# EAGLE design NV08C_GPS_shield (EAGLE 6.4)
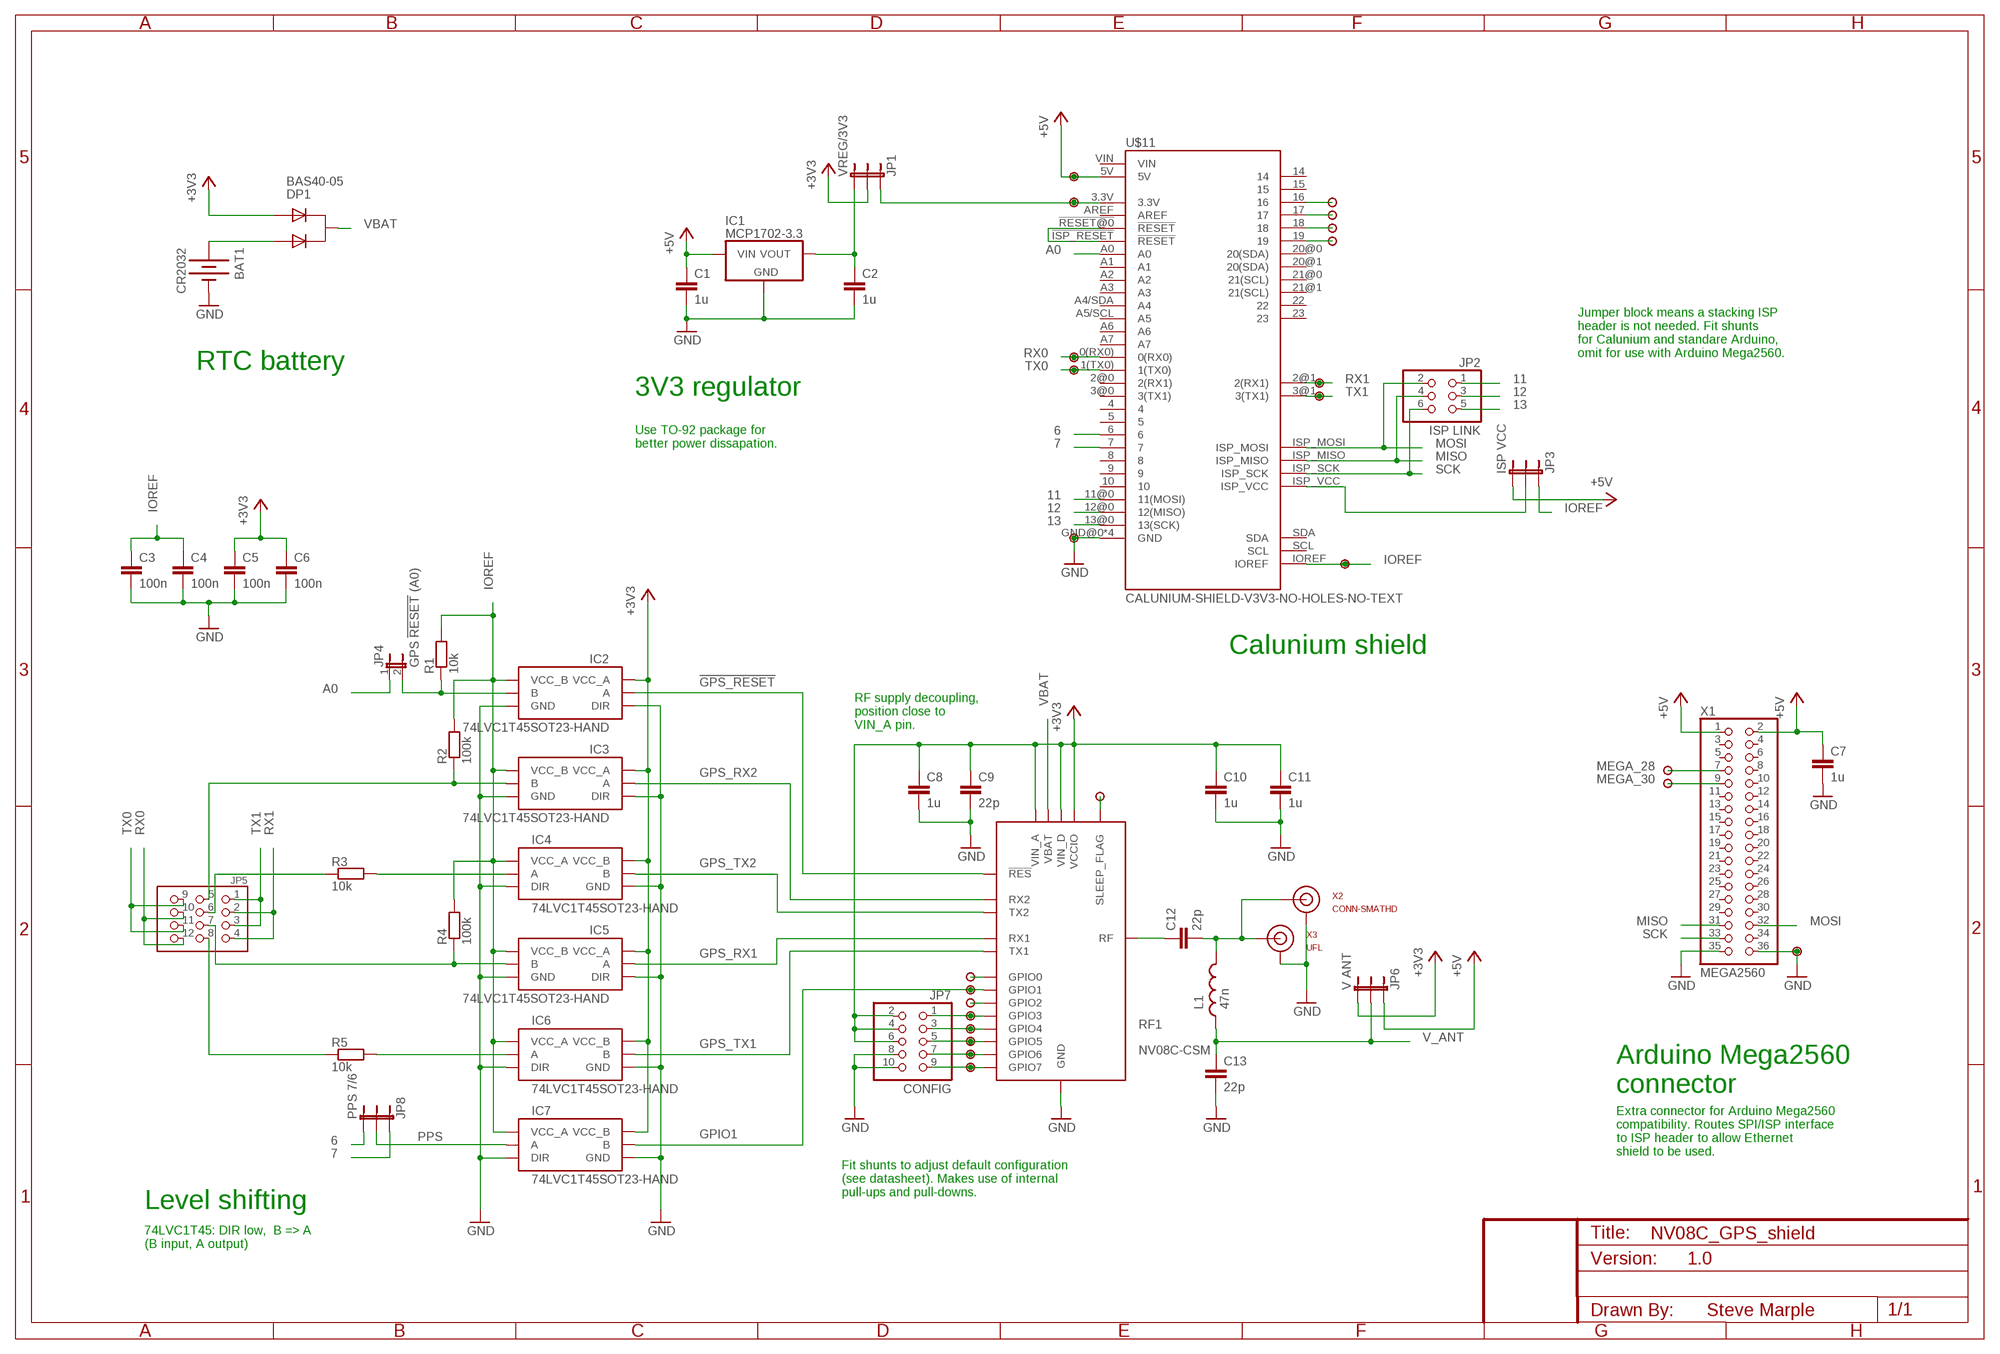
[diagram p0: schematic, sheet 1]

## Parts
BAT1  CR2032  BATTERY20PTH  [BATTCOM_20MM_PTH]
C1  1u  C-EU1206-HAND  [1206-HAND]
C2  1u  C-EU1206-HAND  [1206-HAND]
C3  100n  C-EU1206-HAND  [1206-HAND]
C4  100n  C-EU1206-HAND  [1206-HAND]
C5  100n  C-EU1206-HAND  [1206-HAND]
C6  100n  C-EU1206-HAND  [1206-HAND]
C7  1u  C-EU1206-HAND  [1206-HAND]
C8  1u  C-EU1206-HAND  [1206-HAND]
C9  22p  C-EU0805-HAND  [0805-HAND]
C10  1u  C-EU1206-HAND  [1206-HAND]
C11  1u  C-EU1206-HAND  [1206-HAND]
C12  22p  C-EU0805-HAND  [0805-HAND]
C13  22p  C-EU0805-HAND  [0805-HAND]
DP1  BAS40-05  DIODE-PAIR-COMMON-CATHODE  [SOT23-3-HAND]
IC1  MCP1702-3.3  MCP1702  [TO-92]
IC2  74LVC1T45SOT23-HAND  [SOT23-6-HAND]
IC3  74LVC1T45SOT23-HAND  [SOT23-6-HAND]
IC4  74LVC1T45SOT23-HAND  [SOT23-6-HAND]
IC5  74LVC1T45SOT23-HAND  [SOT23-6-HAND]
IC6  74LVC1T45SOT23-HAND  [SOT23-6-HAND]
IC7  74LVC1T45SOT23-HAND  [SOT23-6-HAND]
JP1  VREG/3V3  JUMPER-3PTH  [1X03]
JP2  ISP LINK  PINHD-2X3  [2X03]
JP3  ISP VCC  JUMPER-3PTH  [1X03]
JP4  GPS !RESET! (A0)  JUMPER-2PTH  [1X02]
JP5  PIN_3X4  [PIN_3X4]
JP6  V ANT  JUMPER-3PTH  [1X03]
JP7  CONFIG  PINHD-2X5  [2X05]
JP8  PPS 7/6  JUMPER-3PTH  [1X03]
L1  47n  INDUCTOR0805-HAND  [0805-HAND]
R1  10k  RESISTOR1206-HAND  [1206-HAND]
R2  100k  RESISTOR1206-HAND  [1206-HAND]
R3  10k  RESISTOR1206-HAND  [1206-HAND]
R4  100k  RESISTOR1206-HAND  [1206-HAND]
R5  10k  RESISTOR1206-HAND  [1206-HAND]
RF1  NV08C-CSM  NV08C-CSMHAND  [NVC08C-CSM-HAND]
U$1  PAD  [PAD]
U$2  PAD  [PAD]
U$3  PAD  [PAD]
U$4  PAD  [PAD]
U$5  PAD  [PAD]
U$6  PAD  [PAD]
U$7  PAD  [PAD]
U$8  PAD  [PAD]
U$9  PAD  [PAD]
U$10  PAD  [PAD]
U$11  CALUNIUM-SHIELD-V3V3-NO-HOLES-NO-TEXT  [CALUNIUM-SHIELD-NO-OUTLINE-NO-HOLES-NO-TEXT-V3]
U$12  PAD  [PAD]
U$13  PAD  [PAD]
U$14  PAD  [PAD]
U$15  PAD  [PAD]
U$16  PAD  [PAD]
U$17  PAD  [PAD]
U$18  PAD  [PAD]
U$19  PAD  [PAD]
U$20  ?  PAD  [PAD]
U$21  PAD  [PAD]
U$22  PAD  [PAD]
U$23  PAD  [PAD]
U$24  PAD  [PAD]
U$25  PAD  [PAD]
X1  MEGA2560  PINHD-2X18  [2X18]
X2  CONN-SMATHD  [SMA-THD]
X3  UFL  CONN-UFLHAND  [CONN-UFL-HAND-SOLDERING]

## Nets
3V3_SHIELD [power]: JP1.1 U$2.1 U$11.3.3V
6: JP8.3 U$11.6
7: JP8.1 U$11.7
11: JP2.1 U$11.11@0(11(MOSI))
12: JP2.3 U$11.12@0(12(MISO))
13: JP2.5 U$11.13@0(13(SCK))
!GPS_RESET: IC2.3(A) RF1.P$25(!RES)
!RESET: U$11.!ISP_RESET(!RESET) U$11.!RESET@0(!RESET)
+3V3 [power]: C5.1 C6.1 C8.1 C9.1 C10.1 C11.1 DP1.2(A2) IC2.1(VCC_A) IC3.1(VCC_A) IC4.6(VCC_B) IC5.1(VCC_A) IC6.6(VCC_B) IC7.6(VCC_B) JP1.2 JP6.3 JP7.2 JP7.4 JP7.6 RF1.P$8(VIN_A) RF1.P$26(VIN_D) RF1.P$28(VCCIO)
+5V [power]: C1.1 C7.1 IC1.2(VIN) JP3.3 JP6.1 U$1.1 U$11.5V X1.1 X1.2
A0: JP4.1 U$11.A0
GND [power]: BAT1.2(-) C1.2 C2.2 C3.2 C4.2 C5.2 C6.2 C7.2 C8.2 C9.2 C10.2 C11.2 C13.2 IC1.1(GND) IC2.2(GND) IC2.5(DIR) IC3.2(GND) IC3.5(DIR) IC4.2(GND) IC4.5(DIR) IC5.2(GND) IC5.5(DIR) IC6.2(GND) IC6.5(DIR) IC7.2(GND) IC7.5(DIR) JP7.8 JP7.10 RF1.P$3(GND) RF1.P$9(GND) RF1.P$10(GND) RF1.P$11(GND) RF1.P$12(GND) RF1.P$13(GND) RF1.P$14(GND) RF1.P$16(GND) RF1.P$17(GND) RF1.P$18(GND) RF1.P$19(GND) RF1.P$22(GND) RF1.P$24(GND) RF1.P$27(GND) RF1.P$29(GND) RF1.P$34(GND) U$11.GND@0(GND) U$11.GND@1(GND) U$11.GND@2(GND) U$11.GND@3(GND) U$12.1 U$17.1 X1.35 X1.36 X2.GND@0(GND) X2.GND@1(GND) X2.GND@2(GND) X2.GND@3(GND) X3.GND@0(GND) X3.GND@1(GND)
GPIO0: RF1.P$20(GPIO0) U$18.1
GPIO1: IC7.4(B) RF1.P$2(GPIO1) U$19.1
GPIO2: RF1.P$1(GPIO2) U$20.1
GPIO3: JP7.1 RF1.P$6(GPIO3) U$21.1
GPIO4: JP7.3 RF1.P$7(GPIO4) U$22.1
GPIO5: JP7.5 RF1.P$4(GPIO5) U$23.1
GPIO6: JP7.7 RF1.P$35(GPIO6) U$24.1
GPIO7: JP7.9 RF1.P$5(GPIO7) U$25.1
GPS_RX1: IC5.3(A) RF1.P$33(RX1)
GPS_RX1_IOREF: IC5.4(B) JP5.7 R4.1
GPS_RX2: IC3.3(A) RF1.P$30(RX2)
GPS_RX2_IOREF: IC3.4(B) JP5.5 R2.1
GPS_TX1: IC6.4(B) RF1.P$32(TX1)
GPS_TX1_IOREF: JP5.8 R5.1
GPS_TX2: IC4.4(B) RF1.P$31(TX2)
GPS_TX2_IOREF: JP5.6 R3.1
IOREF [power]: C3.1 C4.1 IC2.6(VCC_B) IC3.6(VCC_B) IC4.1(VCC_A) IC5.6(VCC_B) IC6.1(VCC_A) IC7.1(VCC_A) JP3.1 R1.2 R2.2 R4.2 U$11.IOREF U$13.1
ISP_VCC [power]: JP3.2 U$11.ISP_VCC
MEGA_28: U$14.1 X1.7
MEGA_30: U$15.1 X1.9
MISO: JP2.4 U$11.ISP_MISO X1.31
MOSI: JP2.2 U$11.ISP_MOSI X1.32
N$1 [power]: C2.1 IC1.3(VOUT) JP1.3
N$2: U$6.1 U$11.19
N$3: IC4.3(A) R3.2
N$4 [antenna]: C12.2 L1.2 X2.SIG(SIGNAL) X3.SIGNAL
N$5: IC6.3(A) R5.2
N$6: U$5.1 U$11.18
N$7 [antenna]: C12.1 RF1.P$15(RF)
N$8: IC2.4(B) JP4.2 R1.1
N$9: U$4.1 U$11.17
N$10: U$3.1 U$11.16
PPS: IC7.3(A) JP8.2
RX0: JP5.10 JP5.12 U$7.1 U$11.0(RX0)
RX1: JP5.2 JP5.4 U$9.1 U$11.2@1(2(RX1))
SCK: JP2.6 U$11.ISP_SCK X1.33
SLEEP_FLAG: RF1.P$21(SLEEP_FLAG) U$16.1
TX0: JP5.9 JP5.11 U$8.1 U$11.1(TX0)
TX1: JP5.1 JP5.3 U$10.1 U$11.3@1(3(TX1))
V_ANT [power]: C13.1 JP6.2 L1.1
VBAT: DP1.3(C) RF1.P$23(VBAT)
VBATT: BAT1.1(+) DP1.1(A1)
Unconnected: U$11.2@0(2(RX1)) U$11.3@0(3(TX1)) U$11.4 U$11.5 U$11.8 U$11.9 U$11.10 U$11.14 U$11.15 U$11.20@0(20(SDA)) U$11.20@1(20(SDA)) U$11.21@0(21(SCL)) U$11.21@1(21(SCL)) U$11.22 U$11.23 U$11.A1 U$11.A2 U$11.A3 U$11.A4/SDA(A4) U$11.A5/SCL(A5) U$11.A6 U$11.A7 U$11.AREF U$11.SCL U$11.SDA U$11.VIN X1.3 X1.4 X1.5 X1.6 X1.8 X1.10 X1.11 X1.12 X1.13 X1.14 X1.15 X1.16 X1.17 X1.18 X1.19 X1.20 X1.21 X1.22 X1.23 X1.24 X1.25 X1.26 X1.27 X1.28 X1.29 X1.30 X1.34

## Notes on the sheet
- Jumper block means a stacking ISP
  header is not needed. Fit shunts
  for Calunium and standare Arduino,
  omit for use with Arduino Mega2560.
- RTC battery
- 3V3 regulator
- Use TO-92 package for
  better power dissapation.
- Calunium shield
- RF supply decoupling,
  position close to
  VIN_A pin.
- Arduino Mega2560
  connector
- Extra connector for Arduino Mega2560
  compatibility. Routes SPI/ISP interface
  to ISP header to allow Ethernet
  shield to be used.
- Fit shunts to adjust default configuration
  (see datasheet). Makes use of internal
  pull-ups and pull-downs.
- Level shifting
- 74LVC1T45: DIR low,  B => A
  (B input, A output)
- 1.0
- Steve Marple

## Library data of the parts
BAT1 = SparkFun:BATTERY: Battery Holders Various common sizes : AA, AAA, 20mm coin cell and 12mm coin cell.
C1-C13 = SteveMarple:C-EU
DP1 = SteveMarple:DIODE-PAIR-COMMON-CATHODE
IC1 = SteveMarple:MCP1702: Microchip MCP1702 250mA loq quiescent current (2uA) LDO voltage regulator.
IC2-IC7 = SteveMarple:74LVC1T45
JP1 JP3 JP6 JP8 = SparkFun:JUMPER-3
JP2 = pinhead:PINHD-2X3: PIN HEADER
JP4 = SparkFun:JUMPER-2: Jumper Basic 0.1" spaced jumper. Use with breakaway headers.
JP5 = pinhead_3row:PIN_3X4
JP7 = pinhead:PINHD-2X5: PIN HEADER
L1 = SteveMarple:INDUCTOR: Inductors Basic Inductor/Choke - 0603 and 1206. Footprints are not proven and vary greatly between part numbers.
R1-R5 = SteveMarple:RESISTOR: 1/4W PTH resistor
RF1 = nvs-tech:NV08C-CSM
U$1-U$10 U$12-U$25 = SteveMarple:PAD
U$11 = SteveMarple:CALUNIUM-SHIELD-V3
X1 = pinhead:PINHD-2X18: PIN HEADER
X2 = SteveMarple:CONN-SMA: SMA connector
X3 = SteveMarple:CONN-UFL

## Net classes
1 power: width 0.381 mm
2 antenna: width 0.66 mm

## Board
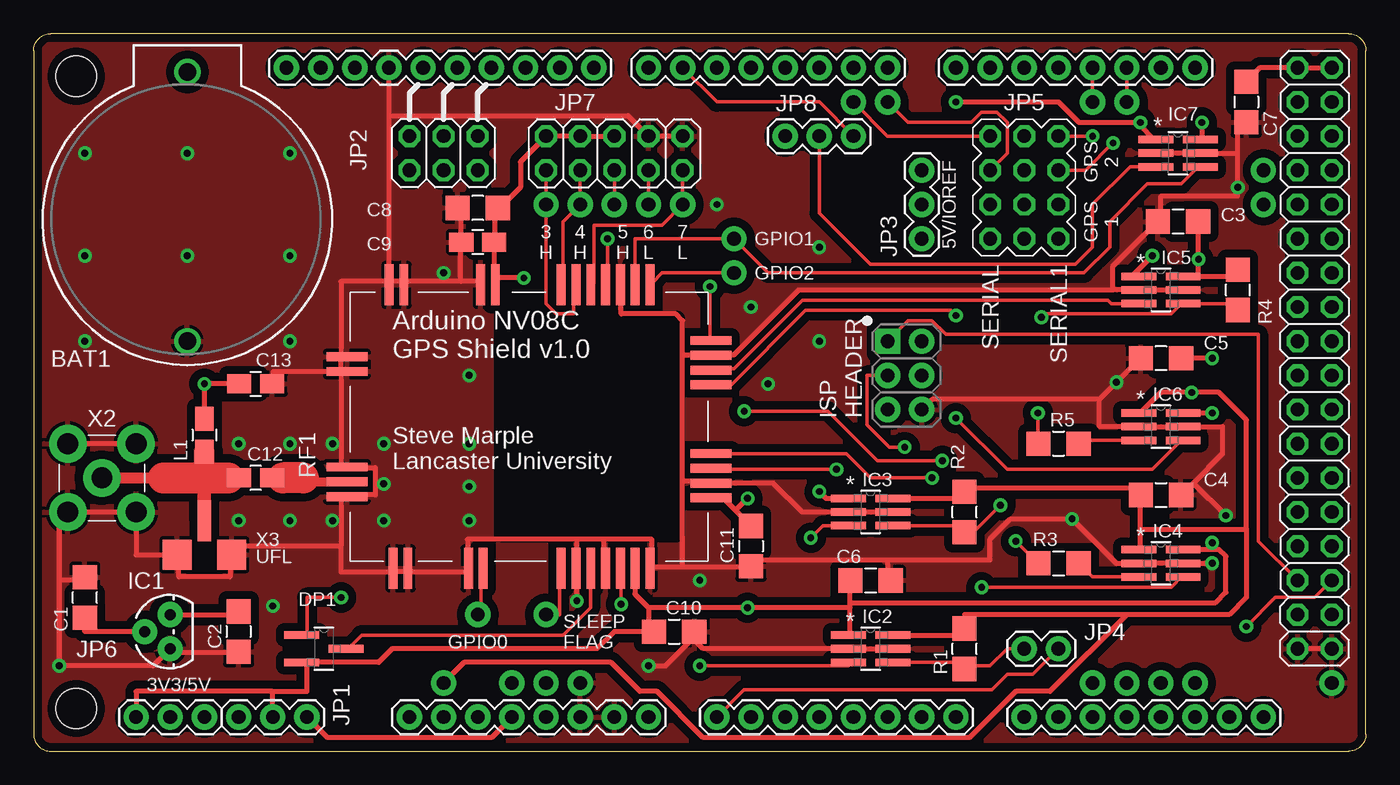
[diagram p1: board, top side]
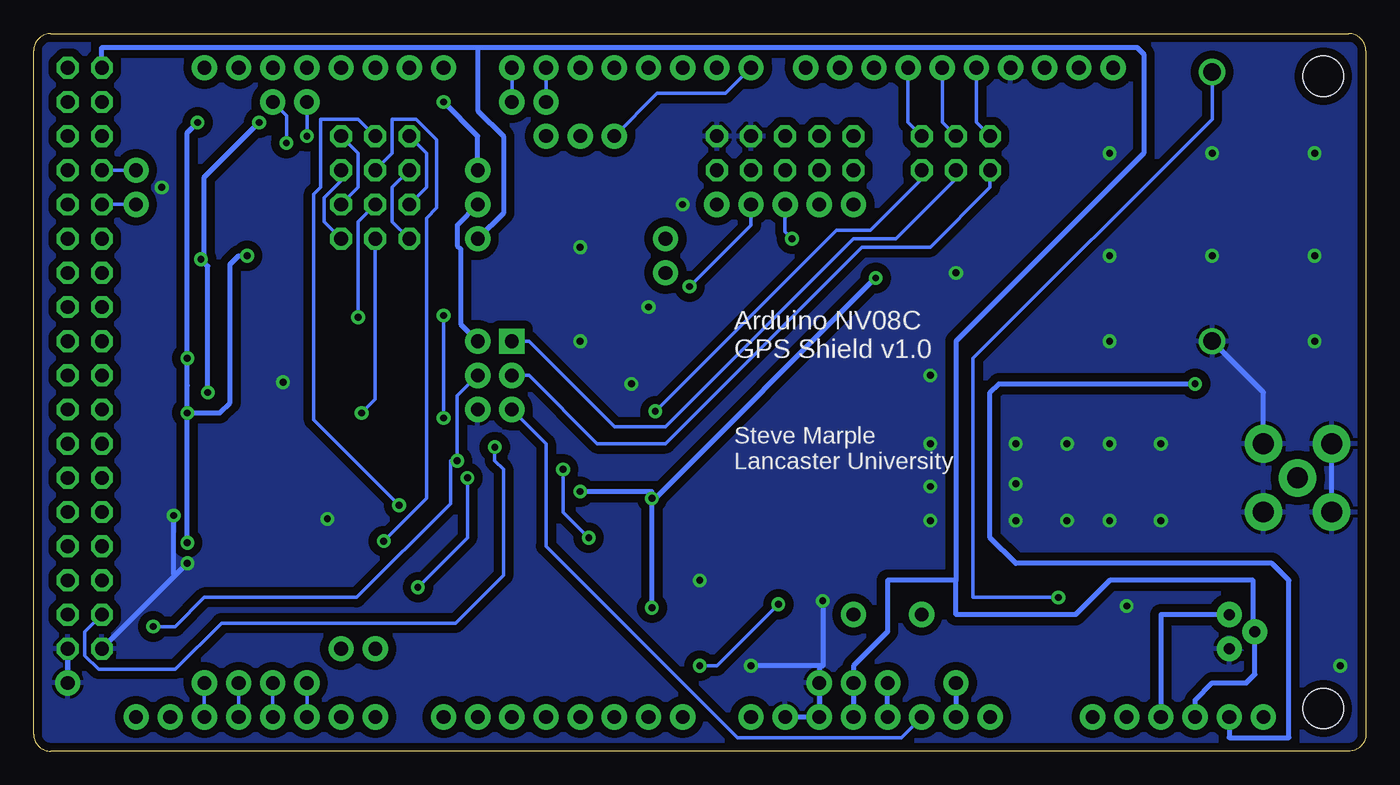
[diagram p2: board, bottom side, seen from below]

Size 99.06 x 53.34 mm. Coordinates in mm from the lower left corner, seen from the top.
Outline: 99.06,1.27 99.06,52.07 arc90 97.79,53.34 1.27,53.34 arc90 0,52.07 0,1.27 arc90 1.27,0 97.79,0 arc90 99.06,1.27
Copper layers (1*16): Top 0.035mm / dielectric 1.5mm / Bottom 0.035mm
Design rules "SparkFun_Iteadstudio_10_12mil": minimum track width 10mil, minimum drill 20mil, track to track 12mil, track to pad 12mil, pad to pad 12mil, via to via 12mil, smd to smd 12mil, copper to edge 0.5mm, drill to drill 8mil, minimum pad ring 12mil, minimum via ring 10mil, stop-mask expansion 4mil, vias tented up to drill 25mil, thermal gap 10mil
Holes 3 mm at 3.17,50.16 3.17,3.17

### Footprints (pad centres in the part's own frame; a part is rotated, then mirrored left to right if it is on the bottom)
BATTCOM_20MM_PTH = drill 1.3: 1 20,0; 2 0,0
1206-HAND = smd 1.8 x 1.803: 1 -1.499,0; 2 1.499,0
0805-HAND = smd 1.8 x 1.4: 1 -1.225,0; 2 1.225,0
SOT23-3-HAND = smd 2.591 x 0.559: 1 -1.651,1.016; 2 -1.651,-1.016; 3 1.651,0
TO-92 = drill 0.813 pad 1.88: 1 -1.27,0; 2 0,1.905; 3 1.27,0
SOT23-6-HAND = smd 2.591 x 0.559: 1 -1.651,1.016; 2 -1.651,0; 3 -1.651,-1.016; 4 1.651,-1.016; 5 1.651,0; 6 1.651,1.016
1X03 = drill 1.016 pad 1.88: 1 0,0; 2 2.54,0; 3 5.08,0
2X03 = drill 1.016 octagon: 1 -2.54,-1.27; 2 -2.54,1.27; 3 0,-1.27; 4 0,1.27; 5 2.54,-1.27; 6 2.54,1.27
1X02 = drill 1.016 pad 1.88: 1 0,0; 2 2.54,0
PIN_3X4 = drill 1.016 octagon: 1 1.27,-1.27; 2 3.81,-1.27; 3 6.35,-1.27; 4 8.89,-1.27; 5 1.27,-3.81; 6 3.81,-3.81; 7 6.35,-3.81; 8 8.89,-3.81; 9 1.27,-6.35; 10 3.81,-6.35; 11 6.35,-6.35; 12 8.89,-6.35
2X05 = drill 1.016 octagon: 1 -5.08,-1.27; 2 -5.08,1.27; 3 -2.54,-1.27; 4 -2.54,1.27; 5 0,-1.27; 6 0,1.27; 7 2.54,-1.27; 8 2.54,1.27; 9 5.08,-1.27; 10 5.08,1.27
NVC08C-CSM-HAND = smd 0.66 x 3.048: P$1 -9,-10.535; P$2 -7.9,-10.535; P$3 -6.8,-10.535; P$4 -5.7,-10.535; P$5 -4.6,-10.535; P$6 -3.5,-10.535; P$7 -2.4,-10.535; P$8 2.5,-10.535; P$9 3.6,-10.535; P$10 9.3,-10.535; P$11 10.4,-10.535; P$17 10.1,10.535; P$18 9,10.535; P$19 4.5,10.535; P$20 3.4,10.535; P$21 -2.4,10.535; P$22 -3.5,10.535; P$23 -4.6,10.535; P$24 -5.7,10.535; P$25 -6.8,10.535; P$26 -7.9,10.535; P$27 -9,10.535 | smd 3.048 x 0.66: P$12 13.535,-5.2; P$13 13.535,-4.1; P$14 13.535,3; P$15 13.535,4.1; P$16 13.535,5.2; P$28 -13.535,5.3; P$29 -13.535,4.2; P$30 -13.535,3.1; P$31 -13.535,2; P$32 -13.535,-3.1; P$33 -13.535,-4.2; P$34 -13.535,-5.3; P$35 -13.535,-6.4
PAD = drill 1.016 pad 1.88: 1 0,0
CALUNIUM-SHIELD-NO-OUTLINE-NO-HOLES-NO-TEXT-V3 = drill 1.016 pad 1.88: 0(RX0) 0,21.59; 1(TX0) -2.54,21.59; 2@0 -5.08,21.59; 2@1 17.78,21.59; 3.3V -27.94,-26.67; 3@0 -7.62,21.59; 3@1 15.24,21.59; 4 -10.16,21.59; 5 -12.7,21.59; 5V -25.4,-26.67; 6 -15.24,21.59; 7 -17.78,21.59; 8 -21.844,21.59; 9 -24.384,21.59; 10 -26.924,21.59; 11@0 -29.464,21.59; 12@0 -32.004,21.59; 13@0 -34.544,21.59; 14 10.16,-26.67; 15 12.7,-26.67; 16 15.24,-26.67; 17 17.78,-26.67; 18 20.32,-26.67; 19 22.86,-26.67; 20@0 25.4,-26.67; 20@1 20.32,21.59; 21@0 27.94,-26.67; 21@1 22.86,21.59; 22 5.08,21.59; 23 7.62,21.59; !ISP_RESET 0,-3.81; !RESET@0 -30.48,-26.67; A0 -12.7,-26.67; A1 -10.16,-26.67; A2 -7.62,-26.67; A3 -5.08,-26.67; A4/SDA -2.54,-26.67; A5/SCL 0,-26.67; A6 2.54,-26.67; A7 5.08,-26.67; AREF -39.624,21.59; GND@0 -22.86,-26.67; GND@1 -20.32,-26.67; GND@2 -37.084,21.59; GND@3 2.54,-3.81; IOREF -33.02,-26.67; ISP_MOSI 2.54,-1.27; ISP_SCK 0,-1.27; ISP_VCC 2.54,1.27; NC -35.56,-26.67; NC@0 12.7,21.59; NC@1 10.16,21.59; SCL -44.704,21.59; SDA -42.164,21.59; VIN -17.78,-26.67 | drill 1.016 pad 1.88 square: ISP_MISO 0,1.27
2X18 = drill 1.016 octagon: 1 -21.59,-1.27; 2 -21.59,1.27; 3 -19.05,-1.27; 4 -19.05,1.27; 5 -16.51,-1.27; 6 -16.51,1.27; 7 -13.97,-1.27; 8 -13.97,1.27; 9 -11.43,-1.27; 10 -11.43,1.27; 11 -8.89,-1.27; 12 -8.89,1.27; 13 -6.35,-1.27; 14 -6.35,1.27; 15 -3.81,-1.27; 16 -3.81,1.27; 17 -1.27,-1.27; 18 -1.27,1.27; 19 1.27,-1.27; 20 1.27,1.27; 21 3.81,-1.27; 22 3.81,1.27; 23 6.35,-1.27; 24 6.35,1.27; 25 8.89,-1.27; 26 8.89,1.27; 27 11.43,-1.27; 28 11.43,1.27; 29 13.97,-1.27; 30 13.97,1.27; 31 16.51,-1.27; 32 16.51,1.27; 33 19.05,-1.27; 34 19.05,1.27; 35 21.59,-1.27; 36 21.59,1.27
SMA-THD = drill 1.549 pad 2.794: GND@0 -2.54,2.54; GND@1 2.54,2.54; GND@2 2.54,-2.54; GND@3 -2.54,-2.54; SIG 0,0
CONN-UFL-HAND-SOLDERING = smd 2.134 x 2.235: GND@0 -2.032,0; GND@1 2.032,0 | smd 1.016 x 3.048: SIGNAL 0,-2.54

### Placement (x,y rotation side)
BAT1  11.43,30.48 90 top
C1  3.81,11.43 90 top
C2  15.24,8.89 270 top
C3  85.09,39.37 180 top
C4  83.82,19.05 0 top
C5  83.82,29.21 180 top
C6  62.23,12.7 0 top
C7  90.17,48.26 270 top
C8  33.02,40.39 180 top
C9  33.02,37.85 180 top
C10  47.62,8.89 0 top
C11  53.34,15.24 270 top
C12  16.51,20.32 180 top
C13  16.51,27.3 0 top
DP1  21.59,7.62 0 top
IC1  10.16,8.89 90 top
IC2  62.23,7.62 0 top
IC3  62.23,17.78 0 top
IC4  83.82,13.97 0 top
IC5  83.82,34.29 0 top
IC6  83.82,24.13 0 top
IC7  85.09,44.45 0 top
JP1  20.32,2.54 180 top
JP2  30.48,44.45 180 top
JP3  66.04,43.18 270 top
JP4  76.2,7.62 180 top
JP5  77.47,46.99 270 top
JP6  12.7,2.54 180 top
JP7  43.18,44.45 0 top
JP8  55.88,45.72 0 top
L1  12.7,23.5 270 top
R1  69.22,7.62 90 top
R2  69.22,17.78 90 top
R3  76.2,13.97 0 top
R4  89.53,34.29 90 top
R5  76.2,22.86 0 top
RF1  36.83,24.13 180 top
U$1  38.1,5.08 0 top
U$2  35.56,5.08 0 top
U$3  78.74,5.08 270 top
U$4  81.28,5.08 270 top
U$5  83.82,5.08 270 top
U$6  86.36,5.08 270 top
U$7  63.5,48.26 0 top
U$8  60.96,48.26 0 top
U$9  81.28,48.26 0 top
U$10  78.74,48.26 0 top
U$11  63.5,29.21 0 top
U$12  40.64,5.08 0 top
U$13  30.48,5.08 0 top
U$14  91.44,43.18 180 top
U$15  91.44,40.64 180 top
U$16  38.1,10.16 270 top
U$17  96.52,5.08 0 top
U$18  33.02,10.16 270 top
U$19  52.07,38.1 270 top
U$20  52.07,35.56 270 top
U$21  38.1,40.64 270 top
U$22  40.64,40.64 270 top
U$23  43.18,40.64 270 top
U$24  45.72,40.64 270 top
U$25  48.26,40.64 270 top
X1  95.25,29.21 270 top
X2  5.08,20.32 270 top
X3  12.7,14.61 180 top

### Tracks (layer width: path | path; a pad name or v marks a point on that pad's centre or on a via)
3V3_SHIELD
  Top 0.381: JP1.1 21.84,1.02 34.04,1.02 U$11.3.3V
  Bottom 0.381: U$11.3.3V U$2.1
6
  Top 0.254: U$11.6 50.8,48.26 58.42,48.26 JP8.3
7
  Bottom 0.254: U$11.7 47.62,48.9 52.7,48.9 JP8.1
11
  Bottom 0.254: JP2.1 34.04,46.74 U$11.11@0
12
  Bottom 0.254: JP2.3 31.5,46.74 U$11.12@0
13
  Bottom 0.254: JP2.5 28.96,46.74 U$11.13@0
!GPS_RESET  (via drill 0.51)
  Top 0.254: v49.53,6.35 60.58,6.35 IC2.3 | v43.69,10.92 43.69,13.46 RF1.P$25
  Bottom 0.254: v43.69,10.92 48.26,6.35 v49.53,6.35
!RESET
  Bottom 0.254: U$11.!RESET@0 34.54,1.02 46.74,1.02 60.96,15.24 60.96,22.86 U$11.!ISP_RESET
+3V3  (via drill 0.51)
  Top 0.381: v87.63,29.21 C5.1 | IC6.6 v87.63,25.15 | v83.19,36.83 81.66,35.31 IC5.1 | v86.87,46.74 86.87,45.47 IC7.6 | JP7.6 JP7.4 JP7.2 36.2,43.81 36.2,41.91 34.92,40.64 34.8,40.89 34.54,40.64 C8.1 34.29,40.64 34.29,38.1 | 20.32,6.6 20.32,4.45 17.78,4.45 | JP1.2 17.78,4.45 | JP6.3 7.62,4.45 17.78,4.45 | 52.2,17.91 51.31,18.8 50.55,18.8 RF1.P$28 | 52.2,17.91 53.34,16.76 C11.1 | v58.42,19.3 58.93,18.8 IC3.1 | 52.2,17.91 v53.09,18.8 | 45.72,10.67 45.72,8.89 | 45.72,8.89 C10.1 | 45.72,10.67 44.7,11.68 44.7,13.46 RF1.P$26 | 60.71,10.67 60.71,8.64 IC2.1 | 60.71,10.67 60.71,11.05 | 60.71,11.05 60.71,12.7 C6.1 | 87.63,14.99 88.14,14.99 88.65,14.48 88.65,11.81 87.88,11.05 60.71,11.05 | 87.63,14.99 IC4.6 | 60.71,10.67 v53.09,10.67 45.72,10.67 | 20.32,6.6 25.65,6.6 26.67,7.62 41.91,7.62 43.18,8.89 45.72,8.89 | 20.32,6.6 DP1.2 | v36.45,35.18 34.54,35.18 RF1.P$8 34.29,34.8 34.29,38.1 | 87.63,14.99 v87.63,15.49 | 34.29,38.1 C9.1
  Bottom 0.381: v87.63,25.15 v87.63,29.21 | v83.19,36.83 83.82,36.83 84.45,36.2 84.45,25.91 85.22,25.15 v87.63,25.15 | v86.87,46.74 87.63,45.97 v87.63,29.21 | 87.63,27.18 v87.63,29.21 | v58.42,19.3 53.09,19.3 v53.09,18.8 53.09,18.54 | v53.09,10.67 53.09,18.54 | 53.09,18.54 v36.45,35.18 | v87.63,15.49 v87.63,25.15
+5V
  Top 0.381: IC1.2 3.81,8.89 C1.1 | C7.1 90.17,49.78 91.19,50.8 X1.1 X1.2
  Bottom 0.381: 30.48,12.7 30.48,10.16 21.59,10.16 19.05,12.7 8.38,12.7 8.38,8.89 IC1.2 8.26,5.71 8.89,5.08 11.43,5.08 12.7,3.81 JP6.1 | 30.48,12.7 35.56,12.7 35.56,8.89 38.1,6.35 U$1.1 U$11.5V | JP3.3 64.14,40.01 64.14,45.72 66.04,47.62 66.04,52.32 | 66.04,52.32 93.98,52.32 X1.1 | 30.48,12.7 30.48,30.48 16.51,44.45 16.51,51.82 17.02,52.32 66.04,52.32
A0
  Top 0.254: U$11.A0 52.83,4.57 71.25,4.57 72.39,5.71 74.3,5.71 JP4.1
GND  (via drill 0.51)
  Top 0.381: X2.GND@0 X2.GND@3 | v1.91,6.35 8.89,6.35 IC1.1 10.16,7.37 15.24,7.37 C2.2 | X2.GND@2 X2.GND@1 7.62,14.61 X3.GND@1 10.79,14.61 10.79,12.95 14.61,12.95 14.61,14.61 X3.GND@0 14.73,15.24 22.86,15.24 | 27.94,13.34 26.67,13.34 | 26.67,13.34 22.86,13.34 22.86,15.24 | 26.67,13.34 RF1.P$17 | 27.94,13.34 32.38,13.34 RF1.P$19 32.26,13.72 32.26,15.75 40.39,15.75 | 27.94,13.34 RF1.P$18 | 22.86,19.05 23.37,18.8 RF1.P$16 22.86,19.05 | C13.2 17.78,27.3 17.78,28.19 23.11,28.19 RF1.P$13 | RF1.P$13 22.86,28.23 22.86,21.13 RF1.P$14 23.37,21.08 25.4,21.08 25.4,19.05 22.86,19.05 | 22.86,29.21 22.86,28.45 RF1.P$13 | JP7.10 JP7.8 44.2,47.24 26.42,47.24 | RF1.P$9 33.02,34.92 31.75,34.92 | 31.75,34.92 27.69,34.92 RF1.P$10 27.43,34.92 26.67,34.92 RF1.P$11 26.42,34.92 | 26.42,34.92 26.42,47.24 | 26.42,47.24 U$11.GND@2 | 22.86,29.21 22.86,34.92 26.42,34.92 | 22.86,29.21 RF1.P$12 | 22.86,19.05 22.86,15.24 | 89.53,44.45 89.53,46.35 C7.2 | 89.53,44.45 IC7.5 IC7.2 | 80.26,34.29 80.26,36.07 83.57,39.37 C3.2 | 80.26,34.29 IC5.2 IC5.5 | 89.53,44.45 89.53,41.27 83.82,41.27 83.82,39.37 C3.2 | 83.31,39.37 C3.2 | IC3.5 IC3.2 57.15,17.78 54.99,19.94 50.55,19.94 RF1.P$29 50.29,20.07 48.26,20.07 | 48.26,29.46 50.29,29.46 RF1.P$34 50.55,29.46 52.07,29.46 56.9,34.29 80.26,34.29 | 48.26,20.07 48.26,29.46 | 48.26,29.46 48.26,32 47.75,32.51 43.69,32.51 43.69,34.54 RF1.P$3 | 86.23,19.94 88.39,22.1 88.39,24.13 IC6.5 IC6.2 79.25,24.13 79.25,26.16 | 86.23,19.94 85.34,19.05 C4.2 | 79.25,26.16 82.3,29.21 C5.2 | U$11.GND@3 66.8,26.16 79.25,26.16 | IC2.5 IC2.2 49.78,7.62 48.51,8.89 C10.2 48.51,8.64 48.9,8.26 46.99,6.35 v45.72,6.35 | X1.36 X1.35
  Top 0.381: 40.39,15.75 40.39,13.72 RF1.P$22 40.39,13.46 v40.39,11.18 | 42.42,15.75 40.39,15.75 | 42.42,15.75 42.42,13.72 RF1.P$24 | 45.97,13.72 48.26,13.72 | 48.26,13.72 53.34,13.72 C11.2 53.34,13.97 53.59,14.22 63.5,14.22 | 45.97,13.72 RF1.P$27 | 63.5,14.22 63.5,12.7 C6.2 | 63.5,14.22 71.12,14.22 71.12,15.75 72.64,17.27 v77.22,17.27 80.52,13.97 IC4.2 IC4.5 v87.63,13.97 | 42.42,15.75 45.97,15.75 45.97,13.72 | v88.65,17.53 86.23,19.94 | 48.26,13.72 48.26,20.07 | 31.75,38.1 31.75,40.64 C8.2 | 31.75,34.92 31.75,38.1 | 31.75,38.1 C9.2 | C1.2 3.81,12.7 1.91,12.7
  Top 0.406: v1.91,6.35 1.91,12.7 1.91,17.14 X2.GND@2
  Bottom 0.381: BAT1.2 7.62,26.67 X2.GND@0 | X2.GND@2 X2.GND@3 | v87.63,13.97 88.52,13.08 | 88.52,13.08 X1.35 | U$11.GND@1 U$11.GND@0 U$12.1 40.64,6.35 | v40.39,11.18 40.39,6.35 40.64,6.35 | 40.64,6.35 v45.72,6.35 | v88.65,17.53 88.65,13.21 88.52,13.08
  Bottom 0.406: U$17.1 X1.36
  other vias: 53.34,33.02 11.43,44.45 3.81,44.45 3.81,30.48 3.81,36.83 11.43,36.83 19.05,36.83 15.24,22.86 49.53,12.7 54.61,27.3 58.42,30.48 58.42,37.47 50.8,40.64 22.23,17.14 22.23,22.86 17.78,10.79 19.05,44.45 30.48,35.56 19.05,17.14 26.04,19.88 26.04,17.14 26.04,22.86 19.05,22.86 32.38,17.14 32.38,19.68 32.38,22.86 32.38,27.94 19.05,30.48 89.53,41.91 80.52,27.43 15.24,17.14
  pour Bottom (isolate 0.61): -2.54,-2.54 -2.54,55.88 101.6,55.88 101.6,-2.54
  pour Top (isolate 0.61): -1.27,-1.27 -1.27,54.61 100.33,54.61 100.33,-1.27
GPIO0
  Top 0.254: U$18.1 33.27,10.16 33.27,13.46 RF1.P$20
GPIO1
  Top 0.254: IC7.4 86.61,43.43 85.34,42.16 82.8,42.16 80.01,39.37 80.01,37.47 78.11,35.56 54.61,35.56 U$19.1 44.7,38.1 44.7,34.8 RF1.P$2
GPIO2
  Top 0.254: U$20.1 46.74,35.56 45.97,34.8 RF1.P$1
GPIO3
  Top 0.254: RF1.P$6 40.13,34.54 40.13,32.51 38.86,32.51 38.1,33.27 U$21.1 JP7.1
GPIO4
  Top 0.254: RF1.P$7 39.37,34.8 39.37,39.37 U$22.1 JP7.3
GPIO5  (via drill 0.51)
  Top 0.254: v42.67,38.1 42.67,34.8 RF1.P$4 | U$23.1 JP7.5
  Bottom 0.254: v42.67,38.1 43.18,38.61 U$23.1
GPIO6  (via drill 0.51)
  Top 0.254: v50.29,34.54 50.29,30.73 RF1.P$35 | U$24.1 JP7.7
  Bottom 0.254: v50.29,34.54 45.72,39.12 U$24.1
GPIO7
  Top 0.254: RF1.P$5 41.66,34.8 41.66,39.12 46.74,39.12 U$25.1 JP7.9
GPS_RX1
  Top 0.254: IC5.3 80.14,33.27 79.88,33.53 57.15,33.53 52.07,28.45 50.55,28.45 RF1.P$33
GPS_RX1_IOREF  (via drill 0.51)
  Top 0.254: R4.1 89.41,33.02 89.15,33.27 IC5.4 85.34,33.27 84.58,32.51 75.18,32.51 v74.93,32.26
  Bottom 0.254: JP5.7 74.93,39.37 v74.93,32.26
GPS_RX2  (via drill 0.51)
  Top 0.254: v57.78,15.88 58.67,16.76 IC3.3 | v59.69,20.95 50.55,20.95 RF1.P$30
  Bottom 0.254: v57.78,15.88 59.69,17.78 v59.69,20.95
GPS_RX2_IOREF  (via drill 0.51)
  Top 0.254: IC3.4 68.83,16.76 69.09,16.51 R2.1 69.34,16.51 70.1,16.51 v71.88,18.29
  Bottom 0.254: JP5.5 74.93,46.99 77.72,46.99 77.72,41.91 78.23,41.4 78.23,24.64 v71.88,18.29
GPS_TX1  (via drill 0.51)
  Top 0.254: v68.58,24.77 72.39,20.95 83.19,20.95 85.34,23.11 IC6.4 | v68.58,32.38 68.2,32.77 57.4,32.77 51.82,27.18 50.55,27.18 RF1.P$32
  Bottom 0.254: v68.58,32.38 v68.58,24.77
GPS_TX1_IOREF  (via drill 0.51)
  Top 0.254: v74.68,25.15 74.68,22.86 R5.1
  Bottom 0.254: v74.68,25.15 73.66,26.16 JP5.8
GPS_TX2  (via drill 0.51)
  Top 0.254: v70.48,12.19 84.58,12.19 85.34,12.95 IC4.4 | v66.8,20.32 62.23,20.32 60.45,22.1 50.55,22.1 RF1.P$31
  Bottom 0.254: v70.48,12.19 66.8,15.88 v66.8,20.32
GPS_TX2_IOREF  (via drill 0.51)
  Top 0.254: v73.03,15.62 74.68,13.97 R3.1
  Bottom 0.254: v73.03,15.62 69.85,18.8 69.85,39.62 69.09,40.39 69.09,45.47 70.61,46.99 72.39,46.99 72.39,44.45 JP5.6
IOREF  (via drill 0.51)
  Top 0.381: 82.17,46.61 82.04,46.74 77.72,46.74 76.2,48.26 v68.58,48.26 | 82.17,46.61 83.31,45.47 IC7.1 | 86.61,35.31 89.15,35.31 89.41,35.56 R4.2 | 86.61,35.31 v86.61,36.58 86.61,39.37 C3.1 | 86.61,35.31 IC5.6 | IC3.6 68.83,18.8 69.09,19.05 R2.2 69.34,19.56 82.04,19.56 82.3,19.05 | IC2.6 68.83,8.64 69.09,8.89 R1.2 69.34,9.14 69.22,9.53 69.22,10.16 81.28,10.16 | 82.3,16.51 82.3,14.99 IC4.1 | 82.3,16.51 82.3,19.05 | 90.17,16.51 90.17,24.64 88.14,26.67 v86.11,26.67 83.82,26.67 82.3,25.15 IC6.1 | 82.3,16.51 90.17,16.51 | 81.28,10.16 88.9,10.16 90.17,11.43 90.17,16.51 | 82.3,19.05 C4.1 | U$13.1 32,6.6 42.93,6.6 45.09,4.45 46.35,4.45 49.78,1.02 69.6,1.02 73.03,4.45 75.56,4.45 81.28,10.16 | v82.3,46.74 82.17,46.61
  Bottom 0.381: v68.58,48.26 66.04,45.72 JP3.1 | U$13.1 U$11.IOREF | v86.11,26.67 86.11,36.07 v86.61,36.58 86.36,36.58 86.36,42.67 v82.3,46.74
ISP_VCC
  Bottom 0.381: U$11.ISP_VCC 67.31,31.75 67.31,37.34 67.56,37.59 67.56,39.12 JP3.2
MEGA_28
  Bottom 0.254: U$14.1 X1.7
MEGA_30
  Bottom 0.254: X1.9 U$15.1
MISO
  Top 0.254: X1.31 91.06,15.62 91.06,30.99 67.82,30.99 66.8,32 65.02,32 U$11.ISP_MISO
  Bottom 0.254: JP2.4 30.48,42.55 34.92,38.1 38.1,38.1 52.07,24.13 55.88,24.13 62.23,30.48 U$11.ISP_MISO
MOSI  (via drill 0.51)
  Top 0.254: v52.83,25.27 59.05,25.27 62.74,21.59 v67.56,21.59 | X1.32 95.25,11.43 92.33,11.43 v90.17,9.27
  Bottom 0.254: v52.83,25.27 39.37,38.73 36.83,38.73 33.02,42.55 JP2.2 | U$11.ISP_MOSI 67.56,26.42 v67.56,21.59 68.07,21.59 68.07,18.41 75.06,11.43 86.36,11.43 88.52,9.27 v90.17,9.27
N$1
  Top 0.381: IC1.3 15.24,10.16 C2.1
  Bottom 0.381: JP1.3 15.24,10.16 IC1.3
N$2
  Bottom 0.254: U$6.1 U$11.19
N$3
  Top 0.254: IC4.3 78.74,12.95 77.72,13.97 R3.2
N$4
  Top 0.762: 14.48,20.32 C12.2
  Top 0.813: X2.SIG 9.65,20.32
  Top 1.016: X3.SIGNAL 12.7,20.32
  Top 1.524: 12.7,20.32 L1.2
  Top 2.311: 9.65,20.32 12.7,20.32 14.48,20.32
N$5
  Top 0.254: IC6.3 77.98,23.11 77.72,22.86 R5.2
N$6
  Bottom 0.254: U$11.18 U$5.1
N$7
  Top 0.66: 20.07,20.32 20.32,20.03 RF1.P$15
  Top 0.762: 18.54,20.32 C12.1
  Top 2.311: 20.07,20.32 18.54,20.32
N$8
  Top 0.254: IC2.4 68.83,6.6 69.09,6.35 R1.1 69.34,6.35 71.12,6.35 72.39,7.62 JP4.2
N$9
  Bottom 0.254: U$4.1 U$11.17
N$10
  Bottom 0.254: U$11.16 U$3.1
PPS
  Top 0.254: JP8.2 58.42,40.01 62.23,36.2 77.47,36.2 78.74,37.47 78.74,40.64 81.53,43.43 IC7.3
RX0
  Top 0.254: U$7.1 65.02,46.74 69.72,46.74 70.48,47.5 71.63,47.5 72.39,46.74 72.39,44.45 JP5.10
  Bottom 0.254: U$11.0(RX0) U$7.1 | JP5.12 72.39,39.37 72.39,41.91 JP5.10
RX1  (via drill 0.51)
  Top 0.254: U$11.2@1 U$9.1 | v80.26,45.21 78.23,43.18 JP5.2
  Bottom 0.254: JP5.4 77.47,39.37 77.47,41.15 76.2,42.42 JP5.2 | U$9.1 80.26,47.24 v80.26,45.21
SCK  (via drill 0.51)
  Top 0.254: v64.77,22.61 63.63,22.61 61.98,24.26 61.98,27.94 U$11.ISP_SCK
  Bottom 0.254: JP2.6 27.94,41.91 32.38,37.47 37.47,37.47 52.07,22.86 57.15,22.86 62.23,27.94 U$11.ISP_SCK | X1.33 95.25,8.89 95.25,7.11 94.23,6.1 88.52,6.1 85.09,9.53 67.69,9.53 64.14,13.08 64.14,20.95 64.77,21.59 v64.77,22.61
SLEEP_FLAG
  Top 0.254: U$16.1 39.12,10.16 39.12,13.46 RF1.P$21
TX0
  Top 0.254: U$8.1 63.5,45.72 JP5.9
  Bottom 0.254: U$11.1(TX0) U$8.1 | JP5.11 69.85,41.91 69.85,44.45 JP5.9
TX1  (via drill 0.51)
  Top 0.254: U$11.3@1 U$10.1 | JP5.1 v78.74,45.72
  Bottom 0.254: JP5.3 74.93,41.91 74.93,44.45 JP5.1 | v78.74,45.72 U$10.1
V_ANT  (via drill 0.51)
  Top 0.381: C13.1 v12.7,27.3 L1.1 12.7,25.15
  Bottom 0.381: v12.7,27.3 27.3,27.3 27.94,26.67 27.94,15.88 26.04,13.97 6.99,13.97 5.71,12.7 5.71,1.02 10.16,1.02 JP6.2
VBAT
  Top 0.254: DP1.3 23.37,7.62 24.38,8.64 39.37,8.64 41.4,10.67 41.4,13.46 RF1.P$23
VBATT  (via drill 0.51)
  Top 0.254: v22.86,11.43 20.32,11.43 20.32,8.64 DP1.1
  Bottom 0.254: v22.86,11.43 29.21,11.43 29.21,29.21 11.43,46.99 BAT1.1

### Text on the board
tSilk: GPS / 2 | 3 / H | 4 / H | 5 / H | 6 / L | 7 / L | GPS / 1 | GPIO1 | GPIO2 | SERIAL | SERIAL1 | ISP / HEADER | SLEEP / FLAG | GPIO0
_tsilk: 5V/IOREF | Arduino NV08C / GPS Shield v1.0 | Steve Marple / Lancaster University | 3V3/5V
_bsilk: Arduino NV08C / GPS Shield v1.0 | Steve Marple / Lancaster University